# EAGLE design pancetta (EAGLE 5.09)
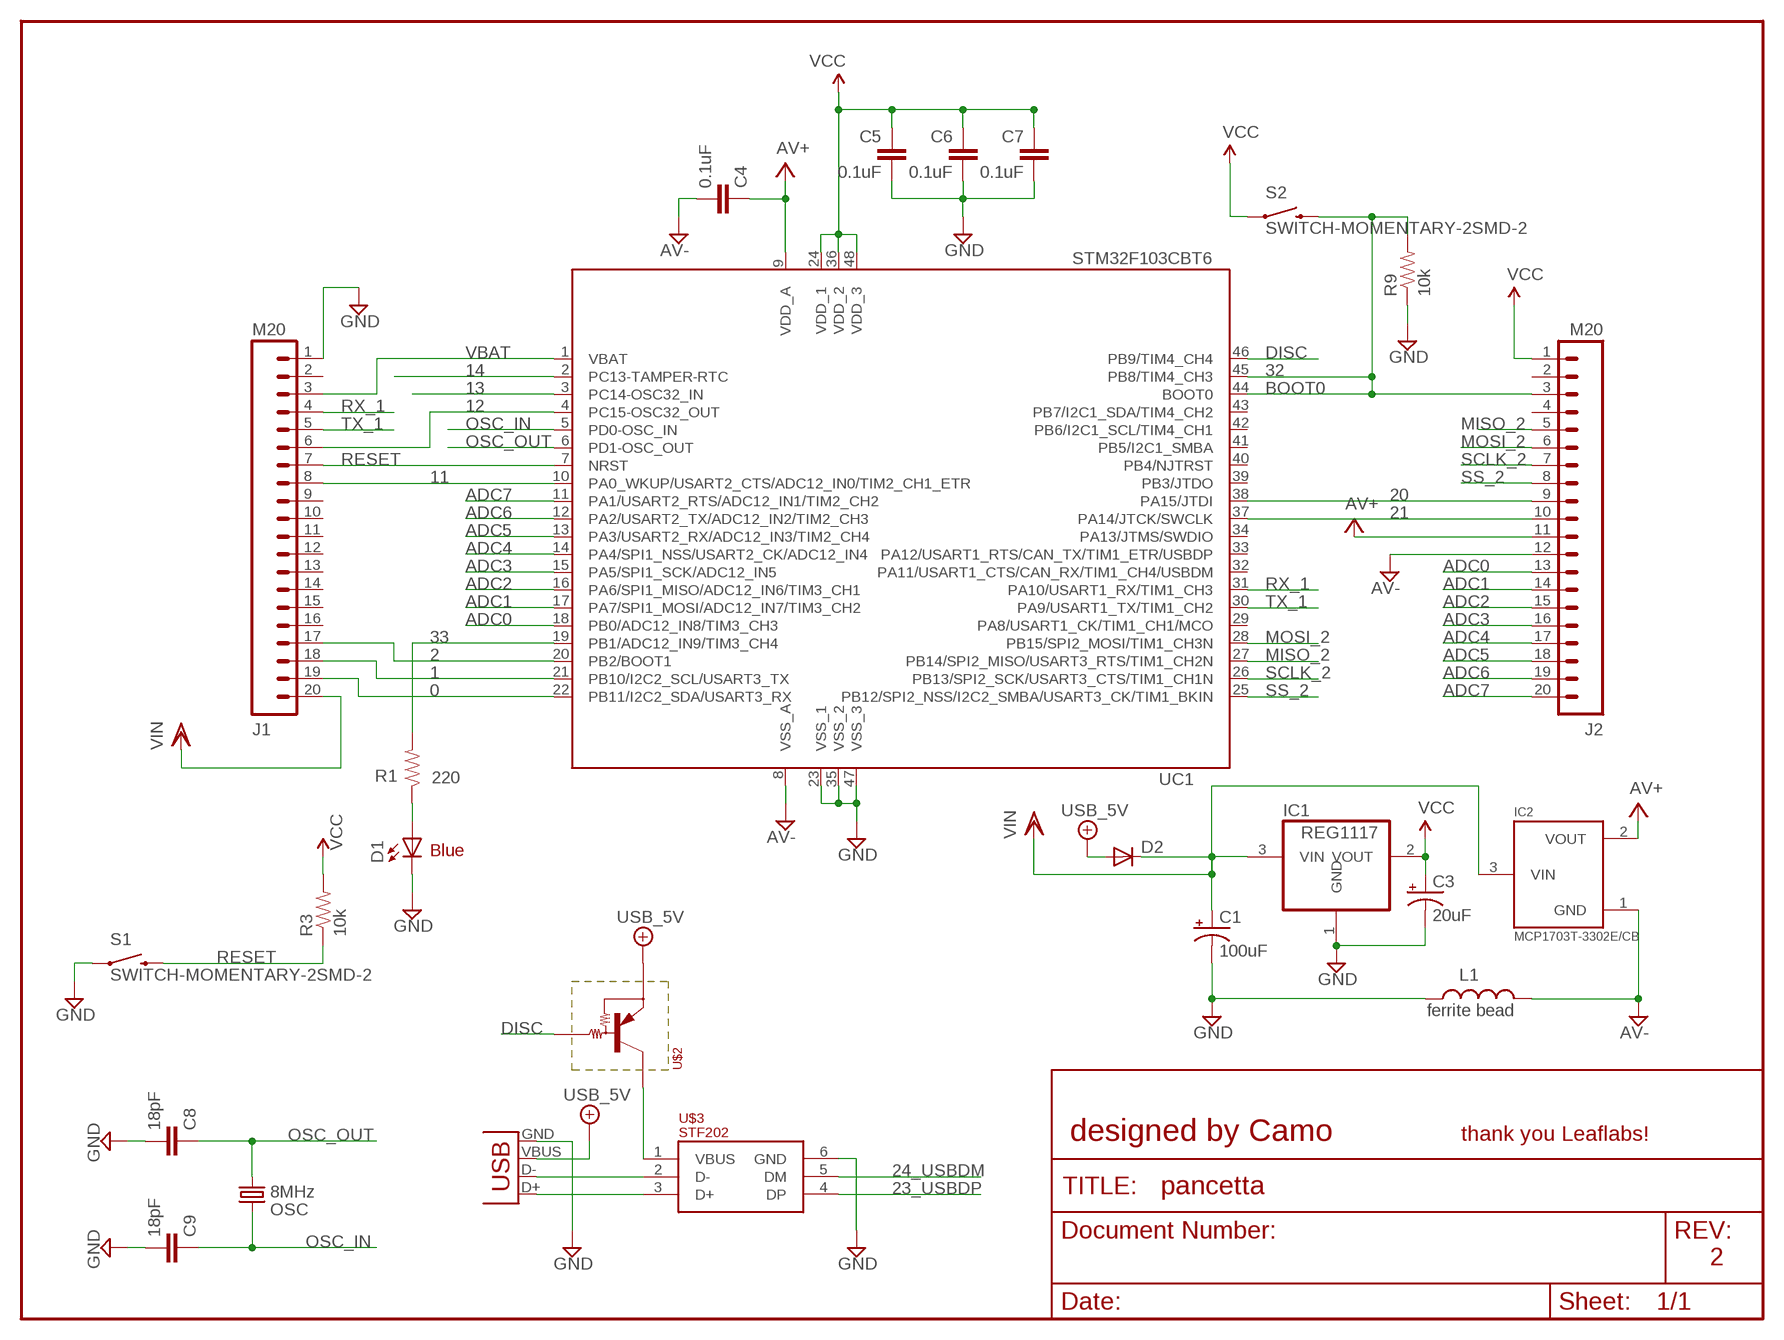
[diagram p0: schematic, sheet 1]

## Parts
C1  100uF  CAP_POL1206  [EIA3216]
C3  20uF  CAP_POL1206  [EIA3216]
C4  0.1uF  CAP0402  [C0402]
C5  0.1uF  CAP0402  [C0402]
C6  0.1uF  CAP0402  [C0402]
C7  0.1uF  CAP0402  [C0402]
C8  18pF  CAP0402  [C0402]
C9  18pF  CAP0402  [C0402]
D1  Blue  LED0603  [LED-0603]
D2  DIODEHV  [DIODE-HV]
IC1  REG1117  [SOT223]
IC2  MCP1703T-3302E/CB  MCP1700T  [SOT23]
J1  M20  [1X20]
J2  M20  [1X20]
L1  ferrite bead  INDUCTOR0402  [C0402]
OSC  8MHz  CRYSTAL5X3  [CRYSTAL-SMD-5X3]
R1  220  RESISTOR0402  [C0402]
R3  10k  RESISTOR0402  [C0402]
R9  10k  RESISTOR0402  [C0402]
S1  SWITCH-MOMENTARY-2SMD-2  [TACTILE_SWITCH_SMD-2]
S2  SWITCH-MOMENTARY-2SMD-2  [TACTILE_SWITCH_SMD-2]
U$2  PDTA114E  [SOT23]
U$3  STF202  [SOT23-6L]
UC1  STM32F103CBT6  STM32F103CB  [LQFP48]
X1  USB-MICROB  [USB-MICROB]

## Nets
0: J1.19 UC1.22(PB11/I2C2_SDA/USART3_RX)
1: J1.18 UC1.21(PB10/I2C2_SCL/USART3_TX)
2: J1.17 UC1.20(PB2/BOOT1)
11: J1.8 UC1.10(PA0_WKUP/USART2_CTS/ADC12_IN0/TIM2_CH1_ETR)
12: J1.6 UC1.4(PC15-OSC32_OUT)
13: UC1.3(PC14-OSC32_IN)
14: UC1.2(PC13-TAMPER-RTC)
20: J2.9 UC1.38(PA15/JTDI)
21: J2.10 UC1.37(PA14/JTCK/SWCLK)
23_USBDP: U$3.4(DP)
24_USBDM: U$3.5(DM)
32: J2.3 R9.2 S2.1 UC1.44(BOOT0) UC1.45(PB8/TIM4_CH3)
33: R1.2 UC1.19(PB1/ADC12_IN9/TIM3_CH4)
+5V/2: D2.A U$2.2(C) X1.VBUS ; supply symbol labelled USB_5V
ADC0: J2.13 UC1.18(PB0/ADC12_IN8/TIM3_CH3)
ADC1: J2.14 UC1.17(PA7/SPI1_MOSI/ADC12_IN7/TIM3_CH2)
ADC2: J2.15 UC1.16(PA6/SPI1_MISO/ADC12_IN6/TIM3_CH1)
ADC3: J2.16 UC1.15(PA5/SPI1_SCK/ADC12_IN5)
ADC4: J2.17 UC1.14(PA4/SPI1_NSS/USART2_CK/ADC12_IN4)
ADC5: J2.18 UC1.13(PA3/USART2_RX/ADC12_IN3/TIM2_CH4)
ADC6: J2.19 UC1.12(PA2/USART2_TX/ADC12_IN2/TIM2_CH3)
ADC7: J2.20 UC1.11(PA1/USART2_RTS/ADC12_IN1/TIM2_CH2)
AGND: J2.12 ; supply symbol labelled AV-
AV+: C4.1 IC2.2(VOUT) UC1.9(VDD_A)
AV-: C4.2 IC2.1(GND) L1.1 UC1.8(VSS_A)
DGND: C1.C(-) C3.C(-) C5.2 C6.2 C7.2 C8.2 C9.2 D1.C IC1.1(GND) J1.1 L1.2 R9.1 S1.2 U$3.6(GND) UC1.23(VSS_1) UC1.35(VSS_2) UC1.47(VSS_3) X1.GND ; supply symbol labelled GND
DISC: U$2.1(B) UC1.46(PB9/TIM4_CH4)
MISO_2: UC1.27(PB14/SPI2_MISO/USART3_RTS/TIM1_CH2N)
MOSI_2: UC1.28(PB15/SPI2_MOSI/TIM1_CH3N)
N$2: D1.A R1.1
N$5: U$2.3(E) U$3.1(VBUS)
N$59: U$3.2(D-) X1.D-
N$60: U$3.3(D+) X1.D+
OSC_IN: C9.1 OSC.3 UC1.5(PD0-OSC_IN)
OSC_OUT: C8.1 OSC.1 UC1.6(PD1-OSC_OUT)
RESET: J1.7 R3.1 S1.1 UC1.7(NRST)
RX_1: J1.4 UC1.31(PA10/USART1_RX/TIM1_CH3)
SCLK_2: UC1.26(PB13/SPI2_SCK/USART3_CTS/TIM1_CH1N)
SS_2: UC1.25(PB12/SPI2_NSS/I2C2_SMBA/USART3_CK/TIM1_BKIN)
TX_1: J1.5 UC1.30(PA9/USART1_TX/TIM1_CH2)
V+: J2.11 ; supply symbol labelled AV+
VBAT: J1.3 UC1.1(VBAT)
VCC: C3.A(+) C5.1 C6.1 C7.1 IC1.2(VOUT) J2.1 R3.2 S2.2 UC1.24(VDD_1) UC1.36(VDD_2) UC1.48(VDD_3)
VIN: C1.A(+) D2.C IC1.3(VIN) IC2.3(VIN) J1.20
Unconnected: J1.2 J1.9 J1.10 J1.11 J1.12 J1.13 J1.14 J1.15 J1.16 J2.2 J2.4 J2.5 J2.6 J2.7 J2.8 UC1.29(PA8/USART1_CK/TIM1_CH1/MCO) UC1.32(PA11/USART1_CTS/CAN_RX/TIM1_CH4/USBDM) UC1.33(PA12/USART1_RTS/CAN_TX/TIM1_ETR/USBDP) UC1.34(PA13/JTMS/SWDIO) UC1.39(PB3/JTDO) UC1.40(PB4/NJTRST) UC1.41(PB5/I2C1_SMBA) UC1.42(PB6/I2C1_SCL/TIM4_CH1) UC1.43(PB7/I2C1_SDA/TIM4_CH2)

## Notes on the sheet
- BOOT0
- Blue
- designed by Camo | thank you Leaflabs!
- 2

## Library data of the parts
C1 C3 = SparkFun3:CAP_POL: Capacitor Polarized These are standard SMD and PTH capacitors. Normally 10uF, 47uF, and 100uF in electrolytic and tantalum varieties. Always verify the external diameter of the through hole cap, it varies with capacity, voltage, and manufacturer. The EIA devices should be standard.
C4-C9 = SparkFun:CAP: Capacitor Standard 0603 ceramic capacitor, and 0.1" leaded capacitor.
D1 = SparkFun:LED: LEDs Standard schematic elements and footprints for 5mm, 3mm, 1206, and 0603 sized LEDs. 5mm - Spark Fun Electronics SKU : COM-00529 (and others)
D2 = SparkFun3:DIODE: Diode These are standard reverse protection diodes and small signal diodes. SMA package can handle up to about 1A. SOD-323 can handle about 200mA. What the SOD-323 package when ordering, there are some mfgs out there that are 5-pin packages.
IC1 = burr-brown:REG1117: 800mA and 1A Low Dropout (LDO) Positive Regulator 1.8V, 2.5V, 2.85V, 3.3V, 5V, and Adj; MPN: REG1117; OC_FARNELL: 1097566; OC_NEWARK: 14P6981
IC2 = okie:MCP1700T
J1 J2 = SparkFun3:M20: This is just like the LOCK variant in that the holes are staggared by 5 mil, but except for the last two holes. They are not altered from the "standard" footprint layout. This is used for a special purpose on the layout of our Graphic LCD Backpack. Make sure you want to use this device before selecting it for you project!
L1 = SparkFun3:INDUCTOR: Inductors Basic Inductor/Choke - 0603 and 1206. Footprints are not proven and vary greatly between part numbers.
OSC = SparkFun2:CRYSTAL: Crystals Various standard crystals. Proven footprints. Spark Fun Electronics SKU : COM-00534
R1 R3 R9 = SparkFun:RESISTOR: Resistor Basic schematic elements and footprints for 0603, 1206, and PTH 1/10th watt (small) resistors.
S1 S2 = SparkFun:SWITCH-MOMENTARY-2
U$2 = bacon:PDTA114E: Transistor with matching resistors (pre biased). Digikey #568-8088-1-ND
U$3 = bacon:STF202: The STF202 is a combination EMI filter and line termination device with integrated TVS diodes for use on upstream USB ports. Digikey Part #STF202-22T1GOSCT-ND
UC1 = stm32:STM32F103CB
X1 = SparkFun:USB: USB Connectors USB-B-PTH is fully proven SKU : PRT-00139 USB-miniB is fully proven SKU : PRT-00587 USB-A-PCB is untested. USB-A-H is throughly reviewed, but untested. Spark Fun Electronics SKU : PRT-00437 USB-B-SMT is throughly reviewed, but untested. Needs silkscreen touching up. USB-A-S has not been used/tested USB-MB-H has not been used/tested

## Net classes
1 vcc: width 0.254 mm

## Board
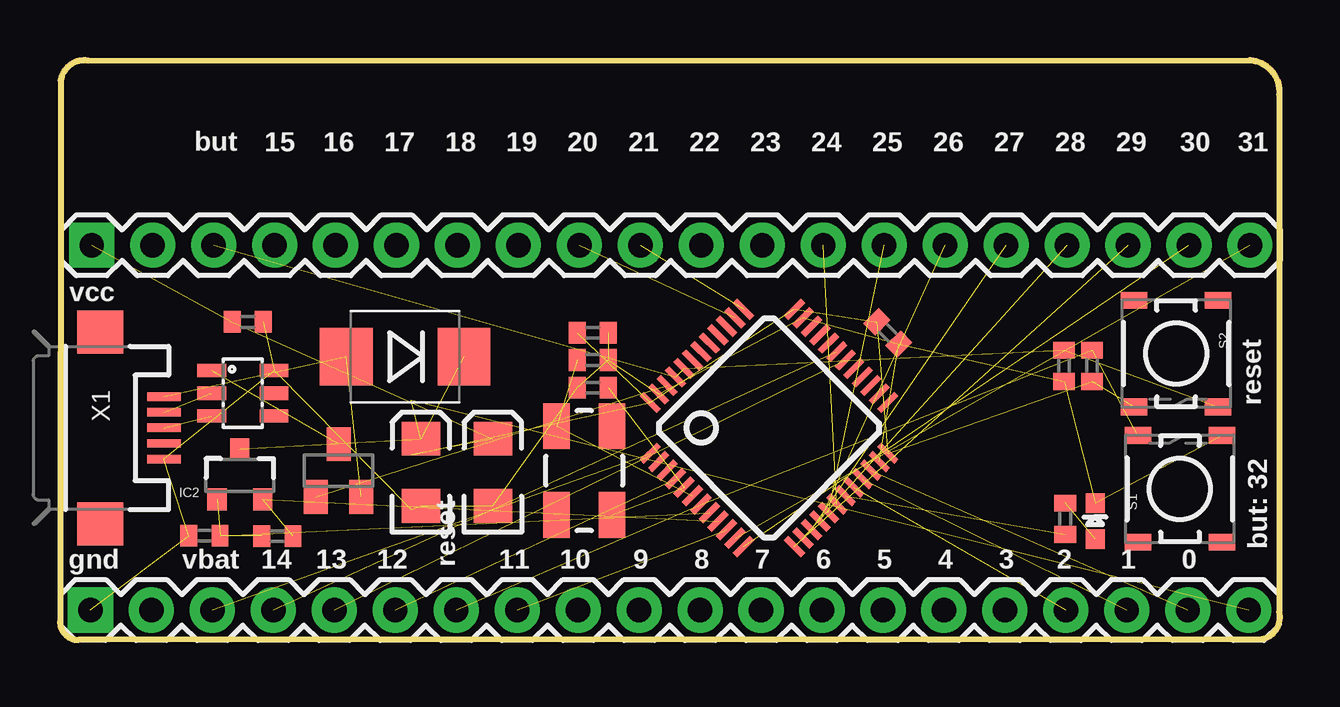
[diagram p1: board, top side]
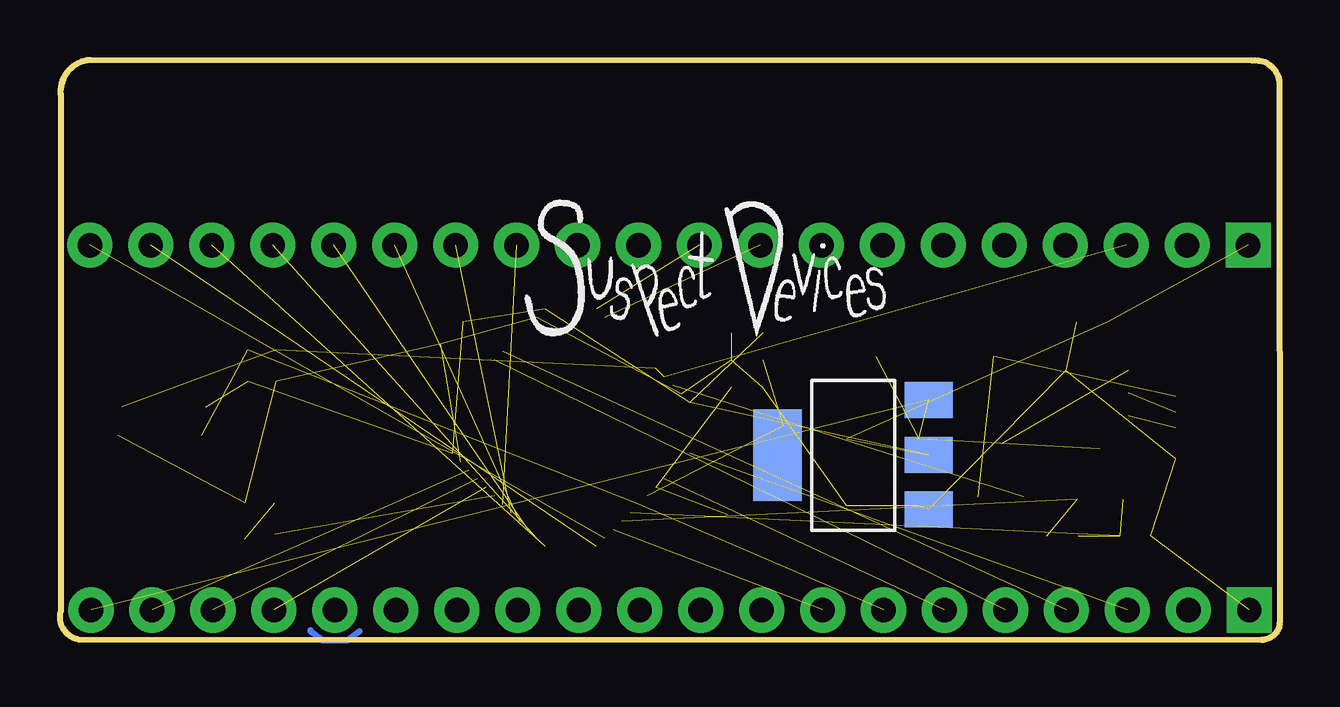
[diagram p2: board, bottom side, seen from below]

Size 50.82 x 24.18 mm. Coordinates in mm from the lower left corner, seen from the top.
Outline: 1.17,24.16 49.58,24.18 arc-90 50.8,22.73 50.8,1.17 arc-90 50.09,0.03 0.76,0 arc-90 0,0.76 0.03,23.32 arc-90 1.17,24.16
Copper layers (1*16): Top 0.0356mm / dielectric 1.5011mm / Bottom 0.0356mm
Design rules "LaenPCBOrder": minimum track width 6mil, minimum drill 13mil, track to track 6mil, track to pad 6mil, pad to pad 6mil, via to via 6mil, smd to smd 6mil, copper to edge 15mil, drill to drill 6mil, minimum pad ring 7mil, minimum via ring 7mil, stop-mask expansion 4mil, vias tented up to drill 0mil, thermal gap 10mil

### Footprints (pad centres in the part's own frame; a part is rotated, then mirrored left to right if it is on the bottom)
EIA3216 = smd 1.4 x 1.6: A 1.4,0; C -1.4,0
C0402 = smd 0.7 x 0.9: 1 -0.65,0; 2 0.65,0
LED-0603 = smd 0.8 x 0.8: A 0,-0.75; C 0,0.75
DIODE-HV = smd 2.2 x 2.4: A 2.454,0; C -2.454,0
SOT223 = smd 1.499 x 2.007: 1 -2.261,-3.15; 2 0.025,-3.15; 3 2.311,-3.15 | smd 3.81 x 2.007: 4 0,3.15
SOT23 = smd 0.8 x 0.9: 1 -0.95,-1; 2 0.95,-1; 3 0,1.1
1X20 = drill 1.016 pad 1.88 square: 1 0,0 | drill 1.016 pad 1.88 round: 2 2.54,0; 3 5.08,0; 4 7.62,0; 5 10.16,0; 6 12.7,0; 7 15.24,0; 8 17.78,0; 9 20.32,0; 10 22.86,0; 11 25.4,0; 12 27.94,0; 13 30.48,0; 14 33.02,0; 15 35.56,0; 16 38.1,0; 17 40.64,0; 18 43.18,0; 19 45.72,0; 20 48.26,0
CRYSTAL-SMD-5X3 = smd 1.9 x 1.1: 1 -1.85,-1.15; 2 1.85,-1.15; 3 1.85,1.15; 4 -1.85,1.15
TACTILE_SWITCH_SMD-2 = smd 0.7 x 1.1: 1 2.225,1.75; 2 2.225,-1.75; 3 -2.225,-1.75; 4 -2.225,1.75
SOT23' = smd 1 x 1.4: 1 -0.95,-1.1; 2 0.95,-1.1; 3 0,1.1
SOT23-6L = smd 0.55 x 1.2: 1 -0.95,-1.3; 2 0,-1.3; 3 0.95,-1.3; 4 0.95,1.3; 5 0,1.3; 6 -0.95,1.3
LQFP48 = smd 0.254 x 1: 1 -2.75,-4.25; 2 -2.25,-4.25; 3 -1.75,-4.25; 4 -1.25,-4.25; 5 -0.75,-4.25; 6 -0.25,-4.25; 7 0.25,-4.25; 8 0.75,-4.25; 9 1.25,-4.25; 10 1.75,-4.25; 11 2.25,-4.25; 12 2.75,-4.25; 25 2.75,4.25; 26 2.25,4.25; 27 1.75,4.25; 28 1.25,4.25; 29 0.75,4.25; 30 0.25,4.25; 31 -0.25,4.25; 32 -0.75,4.25; 33 -1.25,4.25; 34 -1.75,4.25; 35 -2.25,4.25; 36 -2.75,4.25 | smd 1 x 0.254: 13 4.25,-2.75; 14 4.25,-2.25; 15 4.25,-1.75; 16 4.25,-1.25; 17 4.25,-0.75; 18 4.25,-0.25; 19 4.25,0.25; 20 4.25,0.75; 21 4.25,1.25; 22 4.25,1.75; 23 4.25,2.25; 24 4.25,2.75; 37 -4.25,2.75; 38 -4.25,2.25; 39 -4.25,1.75; 40 -4.25,1.25; 41 -4.25,0.75; 42 -4.25,0.25; 43 -4.25,-0.25; 44 -4.25,-0.75; 45 -4.25,-1.25; 46 -4.25,-1.75; 47 -4.25,-2.25; 48 -4.25,-2.75
USB-MICROB = smd 0.35 x 1.4: D+ 0,2.65; D- -0.65,2.65; GND 1.3,2.65; ID 0.65,2.65; VBUS -1.3,2.65 | smd 1.8 x 1.9: MT1 -4,0; MT2 4,0

### Placement (x,y rotation side)
C1  15.04,6.99 90 top
C3  18.03,6.99 90 top
C4  9.05,4.33 180 top
C5  22.2,12.8 0 top
C6  7.82,13.26 0 top
C7  34.49,12.8 314.7 top
C8  22.2,11.67 0 top
C9  22.2,10.52 180 top
D1  43.13,4.95 0 top
D2  14.38,11.81 180 top
IC1  17.78,7.7 90 bottom
IC2  7.49,6.86 0 top
J1  1.27,1.24 0 top
J2  1.32,16.46 0 top
L1  6.02,4.34 180 top
OSC  21.84,7.06 270 top
R1  41.88,5.05 270 top
R3  43,11.43 270 top
R9  41.83,11.43 90 top
S1  46.66,6.3 90 top
S2  46.51,11.94 270 top
U$1  [SUSDEVLOGOSM]  31.55,12.93 0 bottom
U$2  PDTA114E  [SOT23']  11.61,7.06 0 top
U$3  7.62,10.29 270 top
UC1  29.54,8.84 315 top
X1  1.68,8.84 270 top

### Tracks (layer width: path | path; a pad name or v marks a point on that pad's centre or on a via)
0  (1 unrouted)
1  (1 unrouted)
2  (1 unrouted)
11  (1 unrouted)
12  (1 unrouted)
20  (1 unrouted)
21  (1 unrouted)
32  (4 unrouted)
33  (1 unrouted)
+5V/2  (2 unrouted)
ADC0  (1 unrouted)
ADC1  (1 unrouted)
ADC2  (1 unrouted)
ADC3  (1 unrouted)
ADC4  (1 unrouted)
ADC5  (1 unrouted)
ADC6  (1 unrouted)
ADC7  (1 unrouted)
AV+  (2 unrouted)
AV-  (3 unrouted)
DGND  (17 unrouted)
DISC  (1 unrouted)
GND
  Bottom 0.254: 38.35,0.37 38.35,0.36 38.86,-0.03 39.88,-0.03 40.39,0.36 40.38,0.41
N$2  (1 unrouted)
N$5  (1 unrouted)
N$59  (1 unrouted)
N$60  (1 unrouted)
OSC_IN  (2 unrouted)
OSC_OUT  (2 unrouted)
RESET  (3 unrouted)
RX_1  (1 unrouted)
TX_1  (1 unrouted)
VBAT  (1 unrouted)
VCC  (10 unrouted)
VIN  (4 unrouted)

### Text on the board
tNames: but | 15 | 16 | 17 | 18 | 19 | 20 | 21 | 22 | 23 | 24 | 25 | 26 | 27 | 28 | 29 | 30 | 31 | vcc | reset | but: 32 | gnd | vbat | 14 | 13 | 12 | reset | 11 | 10 | 9 | 8 | 7 | 6 | 5 | 4 | 3 | 2 | 1 | 0